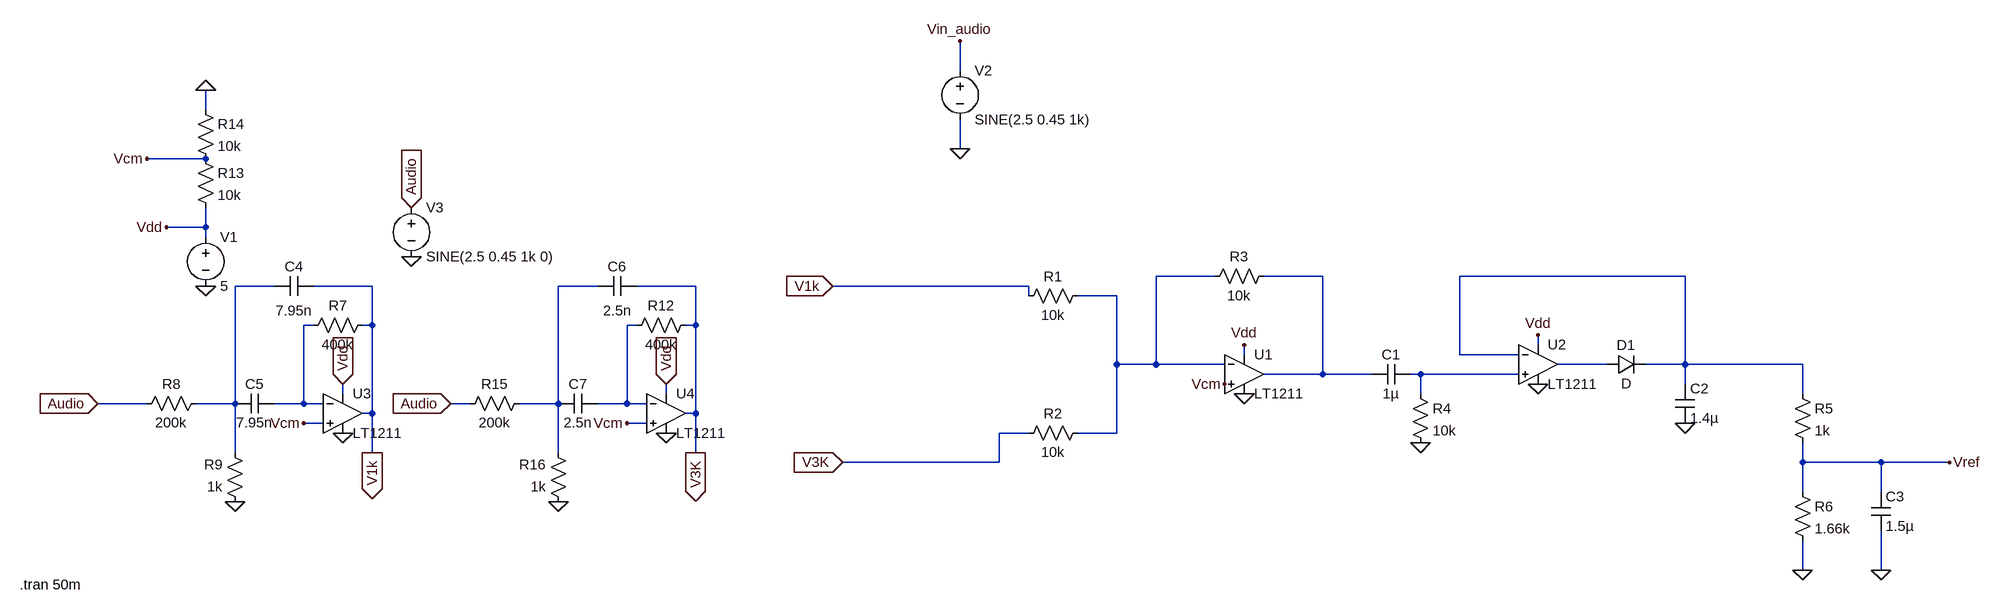
[diagram p0: schematic exp72.asc]
exp72.asc, the LTspice schematic file:
Version 4
SHEET 1 1424 680
WIRE -256 -336 -256 -384
WIRE -1488 -272 -1488 -304
WIRE -256 -208 -256 -256
WIRE -1488 -192 -1584 -192
WIRE -1488 -80 -1488 -112
WIRE -1488 -80 -1552 -80
WIRE -1488 -64 -1488 -80
WIRE 160 0 64 0
WIRE 336 0 240 0
WIRE 928 0 560 0
WIRE -1376 16 -1440 16
WIRE -1216 16 -1312 16
WIRE -848 16 -912 16
WIRE -688 16 -784 16
WIRE -144 16 -464 16
WIRE -144 32 -144 16
WIRE 0 32 -64 32
WIRE -1312 80 -1328 80
WIRE -1216 80 -1216 16
WIRE -1216 80 -1232 80
WIRE -784 80 -800 80
WIRE -688 80 -688 16
WIRE -688 80 -704 80
WIRE 688 112 688 96
WIRE 208 128 208 112
WIRE 560 128 560 0
WIRE 656 128 560 128
WIRE 0 144 0 32
WIRE 64 144 64 0
WIRE 64 144 0 144
WIRE 176 144 64 144
WIRE 800 144 720 144
WIRE 928 144 928 0
WIRE 928 144 864 144
WIRE 1120 144 928 144
WIRE 336 160 336 0
WIRE 336 160 240 160
WIRE 416 160 336 160
WIRE 496 160 480 160
WIRE 656 160 496 160
WIRE 928 176 928 144
WIRE -1264 192 -1264 176
WIRE -736 192 -736 176
WIRE 496 192 496 160
WIRE 1120 192 1120 144
WIRE -1584 208 -1664 208
WIRE -1440 208 -1440 16
WIRE -1440 208 -1504 208
WIRE -1328 208 -1328 80
WIRE -1328 208 -1376 208
WIRE -1296 208 -1328 208
WIRE -1056 208 -1088 208
WIRE -912 208 -912 16
WIRE -912 208 -976 208
WIRE -800 208 -800 80
WIRE -800 208 -848 208
WIRE -768 208 -800 208
WIRE -1216 224 -1216 80
WIRE -1216 224 -1232 224
WIRE -688 224 -688 80
WIRE -688 224 -704 224
WIRE -1296 240 -1328 240
WIRE -768 240 -800 240
WIRE -144 256 -192 256
WIRE 0 256 0 144
WIRE 0 256 -64 256
WIRE -1440 288 -1440 208
WIRE -1216 288 -1216 224
WIRE -912 288 -912 208
WIRE -688 288 -688 224
WIRE -192 304 -192 256
WIRE -192 304 -448 304
WIRE 1120 304 1120 272
WIRE 1248 304 1120 304
WIRE 1360 304 1248 304
WIRE 1120 352 1120 304
WIRE 1248 352 1248 304
WIRE 1120 480 1120 432
WIRE 1248 480 1248 416
FLAG 928 240 0
FLAG 1120 480 0
FLAG 1248 480 0
FLAG 496 272 0
FLAG -1488 16 0
FLAG -1552 -80 Vdd
FLAG -1488 -304 0
FLAG -1584 -192 Vcm
FLAG -256 -384 Vin_audio
FLAG -256 -208 0
FLAG 176 176 Vcm
FLAG 208 112 Vdd
FLAG 688 96 Vdd
FLAG 208 192 0
FLAG 688 176 0
FLAG 1360 304 Vref
FLAG -1440 368 0
FLAG -1264 256 0
FLAG -1264 176 Vdd
IOPIN -1264 176 In
FLAG -1328 240 Vcm
FLAG -1216 288 V1k
IOPIN -1216 288 Out
FLAG -1664 208 Audio
IOPIN -1664 208 In
FLAG -1152 -32 0
FLAG -1152 -112 Audio
IOPIN -1152 -112 In
FLAG -912 368 0
FLAG -736 256 0
FLAG -736 176 Vdd
IOPIN -736 176 In
FLAG -800 240 Vcm
FLAG -688 288 V3K
IOPIN -688 288 Out
FLAG -1088 208 Audio
IOPIN -1088 208 In
FLAG -464 16 V1k
IOPIN -464 16 In
FLAG -448 304 V3K
IOPIN -448 304 In
SYMBOL res -48 16 R90
WINDOW 0 0 56 VBottom 2
WINDOW 3 32 56 VTop 2
SYMATTR InstName R1
SYMATTR Value 10k
SYMBOL res -48 240 R90
WINDOW 0 0 56 VBottom 2
WINDOW 3 32 56 VTop 2
SYMATTR InstName R2
SYMATTR Value 10k
SYMBOL res 256 -16 R90
WINDOW 0 0 56 VBottom 2
WINDOW 3 32 56 VTop 2
SYMATTR InstName R3
SYMATTR Value 10k
SYMBOL cap 480 144 R90
WINDOW 0 0 32 VBottom 2
WINDOW 3 32 32 VTop 2
SYMATTR InstName C1
SYMATTR Value 1µ
SYMBOL res 480 176 R0
SYMATTR InstName R4
SYMATTR Value 10k
SYMBOL diode 800 160 R270
WINDOW 0 32 32 VTop 2
WINDOW 3 0 32 VBottom 2
SYMATTR InstName D1
SYMBOL cap 912 176 R0
SYMATTR InstName C2
SYMATTR Value 1.4µ
SYMBOL res 1104 176 R0
SYMATTR InstName R5
SYMATTR Value 1k
SYMBOL res 1104 336 R0
SYMATTR InstName R6
SYMATTR Value 1.66k
SYMBOL cap 1232 352 R0
SYMATTR InstName C3
SYMATTR Value 1.5µ
SYMBOL voltage -1488 -80 R0
WINDOW 123 0 0 Left 2
WINDOW 39 0 0 Left 2
SYMATTR InstName V1
SYMATTR Value 5
SYMBOL res -1504 -208 R0
SYMATTR InstName R13
SYMATTR Value 10k
SYMBOL res -1504 -288 R0
SYMATTR InstName R14
SYMATTR Value 10k
SYMBOL voltage -256 -352 R0
WINDOW 123 0 0 Left 2
WINDOW 39 0 0 Left 2
SYMATTR InstName V2
SYMATTR Value SINE(2.5 0.45 1k)
SYMBOL Opamps\\LT1211 208 96 R0
SYMATTR InstName U1
SYMBOL Opamps\\LT1211 688 80 R0
SYMATTR InstName U2
SYMBOL res -1216 64 R90
WINDOW 0 0 56 VBottom 2
WINDOW 3 32 56 VTop 2
SYMATTR InstName R7
SYMATTR Value 400k
SYMBOL res -1488 192 R90
WINDOW 0 0 56 VBottom 2
WINDOW 3 32 56 VTop 2
SYMATTR InstName R8
SYMATTR Value 200k
SYMBOL res -1424 384 R180
WINDOW 0 36 76 Left 2
WINDOW 3 36 40 Left 2
SYMATTR InstName R9
SYMATTR Value 1k
SYMBOL cap -1312 0 R90
WINDOW 0 0 32 VBottom 2
WINDOW 3 41 31 VTop 2
SYMATTR InstName C4
SYMATTR Value 7.95n
SYMBOL cap -1440 224 R270
WINDOW 0 32 32 VTop 2
WINDOW 3 0 32 VBottom 2
SYMATTR InstName C5
SYMATTR Value 7.95n
SYMBOL voltage -1152 -128 R0
WINDOW 123 0 0 Left 2
WINDOW 39 0 0 Left 2
SYMATTR InstName V3
SYMATTR Value SINE(2.5 0.45 1k 0)
SYMBOL res -688 64 R90
WINDOW 0 0 56 VBottom 2
WINDOW 3 32 56 VTop 2
SYMATTR InstName R12
SYMATTR Value 400k
SYMBOL res -960 192 R90
WINDOW 0 0 56 VBottom 2
WINDOW 3 32 56 VTop 2
SYMATTR InstName R15
SYMATTR Value 200k
SYMBOL cap -784 0 R90
WINDOW 0 0 32 VBottom 2
WINDOW 3 41 31 VTop 2
SYMATTR InstName C6
SYMATTR Value 2.5n
SYMBOL cap -912 224 R270
WINDOW 0 32 32 VTop 2
WINDOW 3 0 32 VBottom 2
SYMATTR InstName C7
SYMATTR Value 2.5n
SYMBOL res -896 384 R180
WINDOW 0 36 76 Left 2
WINDOW 3 36 40 Left 2
SYMATTR InstName R16
SYMATTR Value 1k
SYMBOL Opamps\\LT1211 -1264 160 R0
SYMATTR InstName U3
SYMBOL Opamps\\LT1211 -736 160 R0
SYMATTR InstName U4
TEXT -1792 504 Left 2 !.tran 50m

The netlist it stands for:
* exp72.asc
R1 N001 V1k 10k
R2 N001 V3K 10k
R3 N002 N001 10k
C1 N009 N002 1µ
R4 N009 0 10k
D1 N008 N003 D
C2 N003 0 1.4µ
R5 N003 Vref 1k
R6 Vref 0 1.66k
C3 Vref 0 1.5µ
V1 Vdd 0 5
R13 Vcm Vdd 10k
R14 0 Vcm 10k
V2 Vin_audio 0 SINE(2.5 0.45 1k)
XU1 Vcm N001 Vdd 0 N002 LT1211  ; pins In+ In- V+ V- OUT
XU2 N009 N003 Vdd 0 N008 LT1211  ; pins In+ In- V+ V- OUT
R7 V1k N006 400k
R8 N004 Audio 200k
R9 0 N004 1k
C4 V1k N004 7.95n
C5 N004 N006 7.95n
V3 Audio 0 SINE(2.5 0.45 1k 0)
R12 V3K N007 400k
R15 N005 Audio 200k
C6 V3K N005 2.5n
C7 N005 N007 2.5n
R16 0 N005 1k
XU3 Vcm N006 Vdd 0 V1k LT1211  ; pins In+ In- V+ V- OUT
XU4 Vcm N007 Vdd 0 V3K LT1211  ; pins In+ In- V+ V- OUT
.model D D
.lib standard.dio
.tran 50m
.lib LTC.lib
.backanno
.end